# EasyEDA Pro project ProPrj_大功率电调_2026-08-17.epro, schematic 大功率电调V1.2
Assembly Variant: Basic; Board Name: Board1; Create Date: 2026-07-23; Page Name: P1; Project Name: 大功率电调; Schematic Name: Schematic1; Update Date: 2026-07-23; Company: 嘉立创EDA; Page Size: A4; Version: V1.0
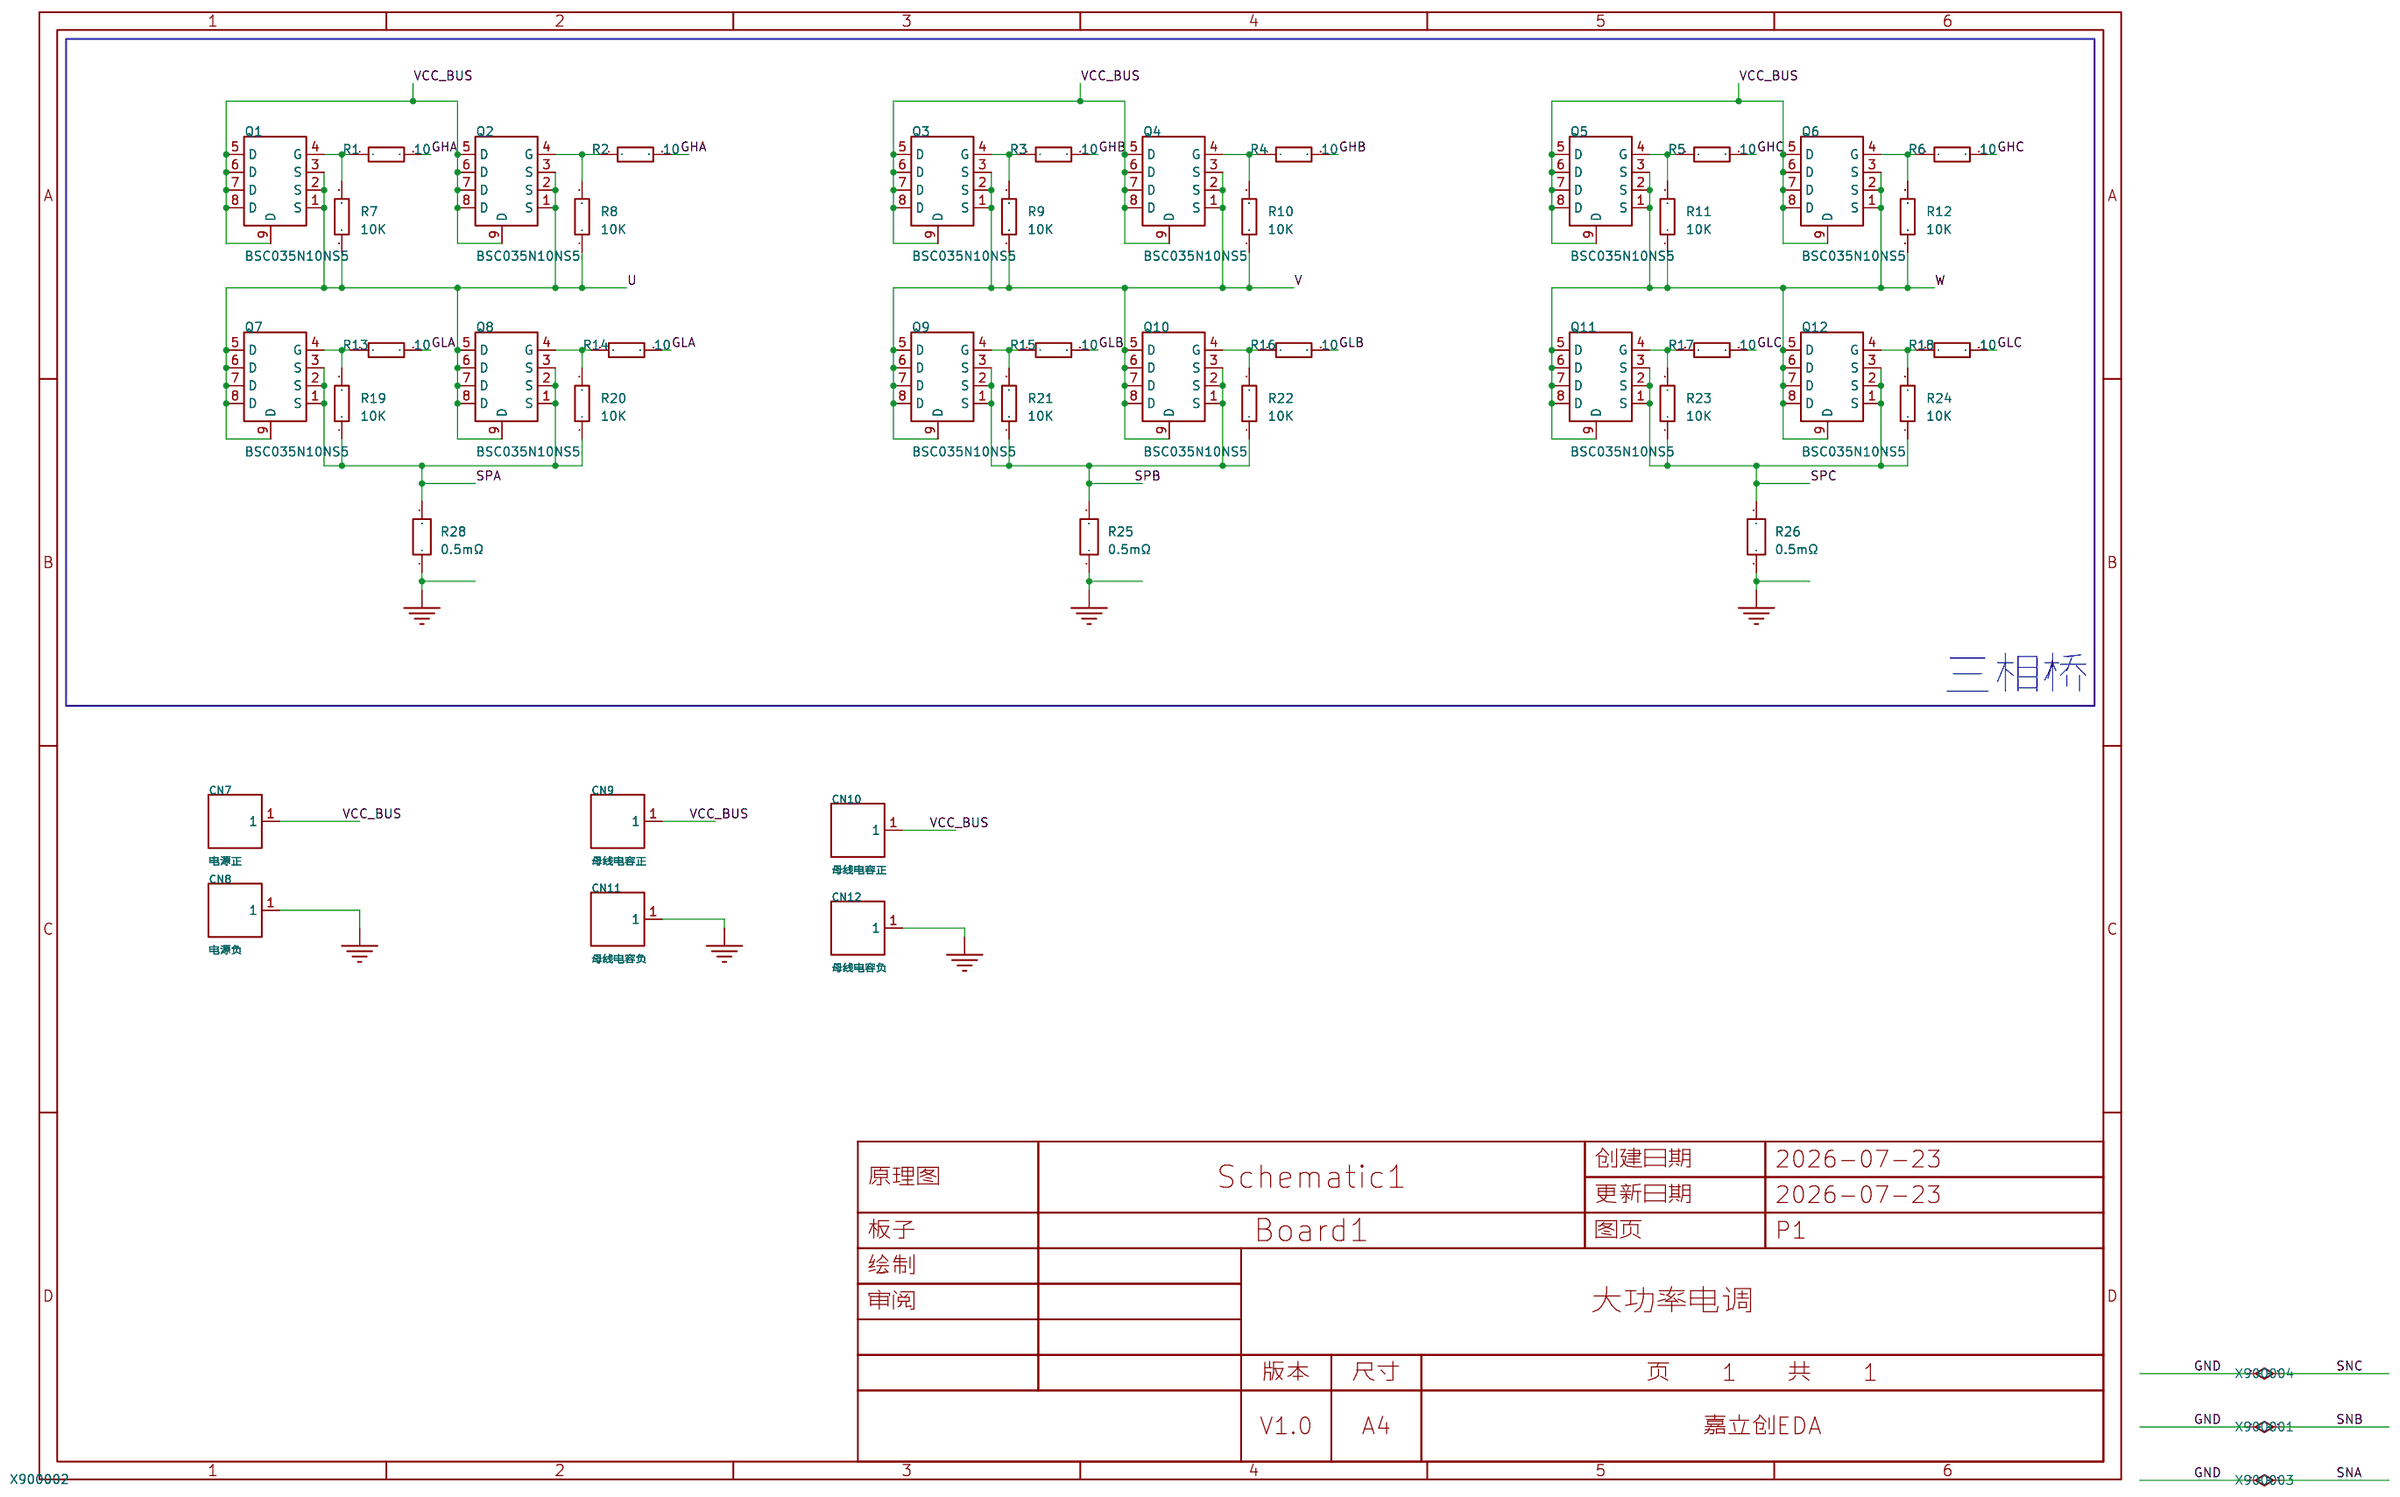
[diagram p0: schematic sheet]

## Parts
CN7  电源正  [单焊盘_贴片_矩形_2X2_1脚]
CN8  电源负  [单焊盘_贴片_矩形_2X2_1脚]
CN9  母线电容正  [单焊盘_贴片_矩形_2X2_1脚]
CN10  母线电容正  [单焊盘_贴片_矩形_2X2_1脚]
CN11  母线电容负  [单焊盘_贴片_矩形_2X2_1脚]
CN12  母线电容负  [单焊盘_贴片_矩形_2X2_1脚]
Q1  BSC035N10NS5  [PG-TDSON-8_L5.2-W5.9-P1.27-LS6.2-BL-EP]
Q2  BSC035N10NS5  [PG-TDSON-8_L5.2-W5.9-P1.27-LS6.2-BL-EP]
Q3  BSC035N10NS5  [PG-TDSON-8_L5.2-W5.9-P1.27-LS6.2-BL-EP]
Q4  BSC035N10NS5  [PG-TDSON-8_L5.2-W5.9-P1.27-LS6.2-BL-EP]
Q5  BSC035N10NS5  [PG-TDSON-8_L5.2-W5.9-P1.27-LS6.2-BL-EP]
Q6  BSC035N10NS5  [PG-TDSON-8_L5.2-W5.9-P1.27-LS6.2-BL-EP]
Q7  BSC035N10NS5  [PG-TDSON-8_L5.2-W5.9-P1.27-LS6.2-BL-EP]
Q8  BSC035N10NS5  [PG-TDSON-8_L5.2-W5.9-P1.27-LS6.2-BL-EP]
Q9  BSC035N10NS5  [PG-TDSON-8_L5.2-W5.9-P1.27-LS6.2-BL-EP]
Q10  BSC035N10NS5  [PG-TDSON-8_L5.2-W5.9-P1.27-LS6.2-BL-EP]
Q11  BSC035N10NS5  [PG-TDSON-8_L5.2-W5.9-P1.27-LS6.2-BL-EP]
Q12  BSC035N10NS5  [PG-TDSON-8_L5.2-W5.9-P1.27-LS6.2-BL-EP]
R1  10  [R0603]
R2  10  [R0603]
R3  10  [R0603]
R4  10  [R0603]
R5  10  [R0603]
R6  10  [R0603]
R7  10K  [R0603]
R8  10K  [R0603]
R9  10K  [R0603]
R10  10K  [R0603]
R11  10K  [R0603]
R12  10K  [R0603]
R13  10  [R0603]
R14  10  [R0603]
R15  10  [R0603]
R16  10  [R0603]
R17  10  [R0603]
R18  10  [R0603]
R19  10K  [R0603]
R20  10K  [R0603]
R21  10K  [R0603]
R22  10K  [R0603]
R23  10K  [R0603]
R24  10K  [R0603]
R25  0.5mΩ  [RES-SMD_L6.4-W3.2_RLP25]
R26  0.5mΩ  [RES-SMD_L6.4-W3.2_RLP25]
R28  0.5mΩ  [RES-SMD_L6.4-W3.2_RLP25]

## Library data of the parts
CN7-CN12 = 单焊盘 COPY: 单焊盘； / 贴片； / 矩形，2mmx2mm； / 1脚；; Supplier Part: C163146; Manufacturer: HIWA; Manufacturer Part: PA007-2P
Q1-Q12 = BSC035N10NS5: 数量:1个N沟道;漏源电压(Vdss):100V;连续漏极电流(Id):100A;导通电阻(RDS(on)):3.5mΩ@10V;耗散功率(Pd):156W;阈值电压(Vgs(th)):3.8V;; LCSC Part Name: 1个N沟道 耐压:100V 电流:100A; Supplier Part: C2832245; Manufacturer: Infineon(英飞凌); Supplier Footprint: TDSON-8(5x6); JLCPCB Part Class: Extended Part; Datasheet: https://item.szlcsc.com/datasheet/BSC035N10NS5/2989763.html; Supplier: LCSC; Number: 1个N沟道; Drain to Source Voltage: 100V; Current - Continuous Drain(Id): 100A; RDS(on): 3.5mΩ@10V; Pd - Power Dissipation: 156W; Gate Threshold Voltage (Vgs(th)): 3.8V; Gate Charge(Qg): 87nC@10V; Input Capacitance(Ciss): 6.5nF; Reverse Transfer Capacitance (Crss@Vds): 60pF; Operating Temperature: -55℃~+150℃; Type: N沟道; Output Capacitance(Coss): 1nF
R1-R24 = Res_0603: Supplier Footprint: 0603
R25 R26 R28 = RE2512F3R0R5L: 电阻类型:采样电阻；合金电阻;阻值:0.5mΩ;精度:±1%;功率:3W;温度系数:±100ppm/℃;; LCSC Part Name: 0.5mΩ 3W 2512 ±1%; Supplier Part: C46961744; Manufacturer: JIERR(捷而瑞); Supplier Footprint: 2512; JLCPCB Part Class: Extended Part; Datasheet: https://item.szlcsc.com/datasheet/RE2512F3R0R5L/49133283.html; Supplier: LCSC; Type: 采样电阻；合金电阻; Tolerance: ±1%; Power(Watts): 3W; Temperature Coefficient: ±100ppm/℃

## Nets
GND: CN8.1 CN11.1 CN12.1 R25.1 R26.1 R28.1
VCC_BUS: CN7.1 CN9.1 CN10.1 Q1.5(D) Q1.6(D) Q1.7(D) Q1.8(D) Q1.9(D) Q2.5(D) Q2.6(D) Q2.7(D) Q2.8(D) Q2.9(D) Q3.5(D) Q3.6(D) Q3.7(D) Q3.8(D) Q3.9(D) Q4.5(D) Q4.6(D) Q4.7(D) Q4.8(D) Q4.9(D) Q5.5(D) Q5.6(D) Q5.7(D) Q5.8(D) Q5.9(D) Q6.5(D) Q6.6(D) Q6.7(D) Q6.8(D) Q6.9(D)
GHA: R1.2 R2.2
GHB: R3.2 R4.2
GHC: R5.2 R6.2
GLA: R13.2 R14.2
GLB: R15.2 R16.2
GLC: R17.2 R18.2
SPA: Q7.1(S) Q7.2(S) Q7.3(S) Q8.1(S) Q8.2(S) Q8.3(S) R19.1 R20.1 R28.2
SPB: Q9.1(S) Q9.2(S) Q9.3(S) Q10.1(S) Q10.2(S) Q10.3(S) R21.1 R22.1 R25.2
SPC: Q11.1(S) Q11.2(S) Q11.3(S) Q12.1(S) Q12.2(S) Q12.3(S) R23.1 R24.1 R26.2
U: Q1.1(S) Q1.2(S) Q1.3(S) Q2.1(S) Q2.2(S) Q2.3(S) Q7.5(D) Q7.6(D) Q7.7(D) Q7.8(D) Q7.9(D) Q8.5(D) Q8.6(D) Q8.7(D) Q8.8(D) Q8.9(D) R7.1 R8.1
V: Q3.1(S) Q3.2(S) Q3.3(S) Q4.1(S) Q4.2(S) Q4.3(S) Q9.5(D) Q9.6(D) Q9.7(D) Q9.8(D) Q9.9(D) Q10.5(D) Q10.6(D) Q10.7(D) Q10.8(D) Q10.9(D) R9.1 R10.1
W: Q5.1(S) Q5.2(S) Q5.3(S) Q6.1(S) Q6.2(S) Q6.3(S) Q11.5(D) Q11.6(D) Q11.7(D) Q11.8(D) Q11.9(D) Q12.5(D) Q12.6(D) Q12.7(D) Q12.8(D) Q12.9(D) R11.1 R12.1
$1N249: Q1.4(G) R1.1 R7.2
$1N251: Q2.4(G) R2.1 R8.2
$1N253: Q7.4(G) R13.1 R19.2
$1N255: Q8.4(G) R14.1 R20.2
$1N257: Q9.4(G) R15.1 R21.2
$1N259: Q3.4(G) R3.1 R9.2
$1N261: Q10.4(G) R16.1 R22.2
$1N263: Q4.4(G) R4.1 R10.2
$1N265: Q11.4(G) R17.1 R23.2
$1N267: Q5.4(G) R5.1 R11.2
$1N269: Q12.4(G) R18.1 R24.2
$1N271: Q6.4(G) R6.1 R12.2

## Notes on the sheet
- 三相桥
